# Altium schematic sheet JQ8400-FL语音模块原理图V1.1.SchDoc
size B; SheetNumber: 0; SheetTotal: 0
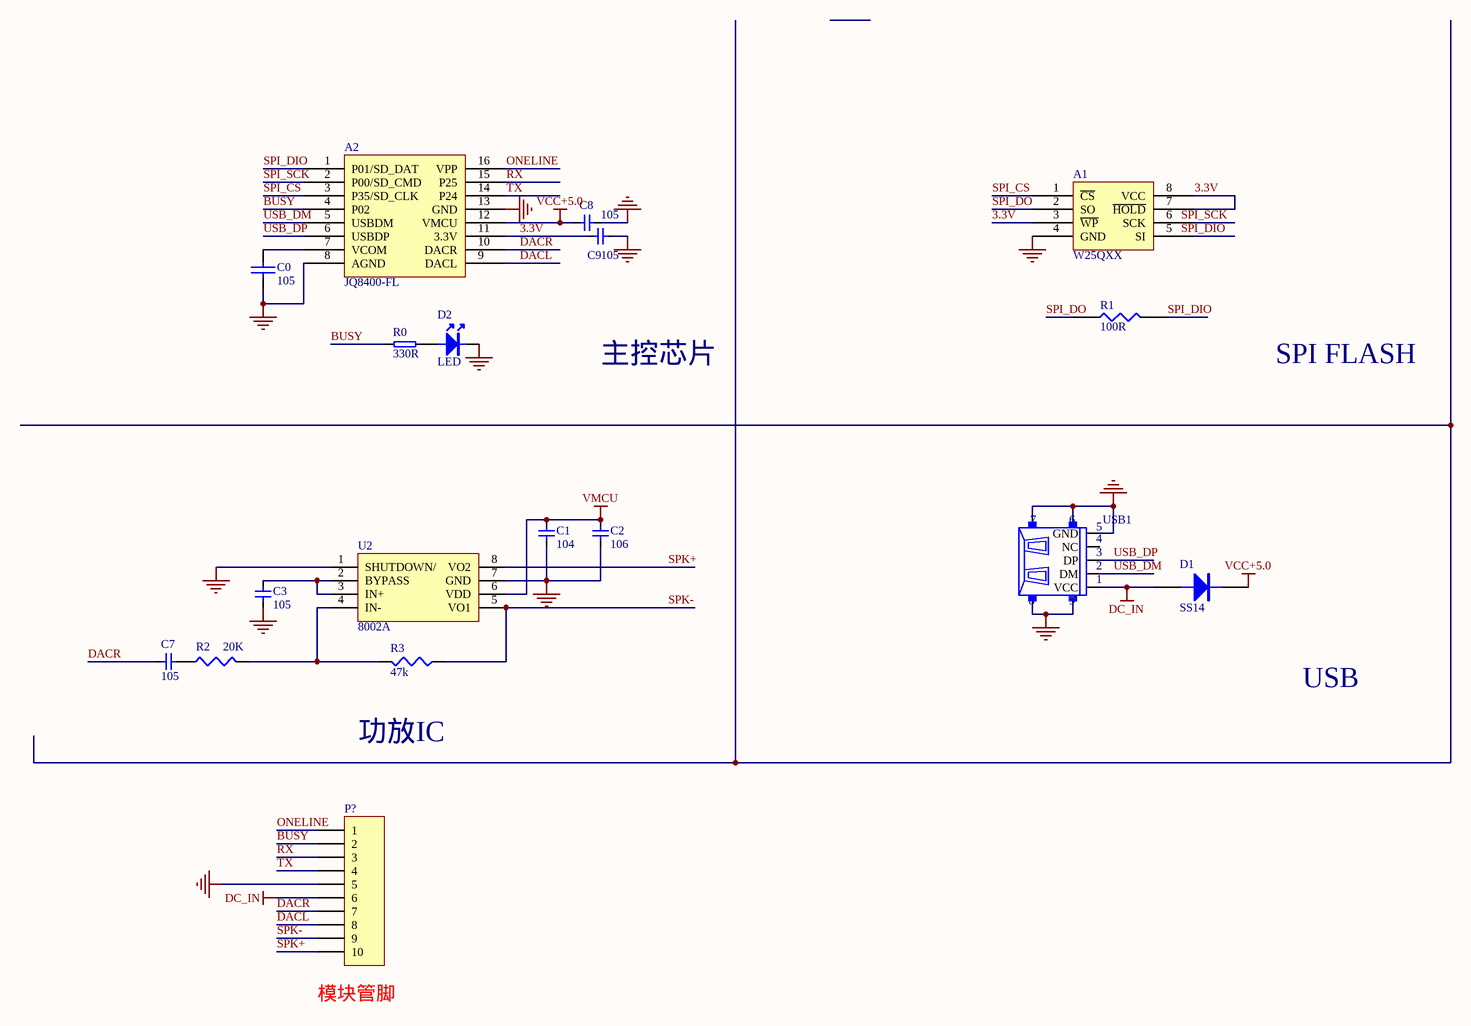
[diagram p0: JQ8400-FL语音模块原理图V1.1.SchDoc]

## Parts
A1  W25QXX  [LC-SOIC-8_208mil]
A2  JQ8400-FL  [LC-SOIC-16_150mil]
C0  105
C1  104  [LC-0603_C]
C2  106  [LC-0603_C]
C3  105  [LC-0603_C]
C7  105  [LC-0603_C]
C8  105  [LC-0603_C]
C9  105  [LC-0603_C]
D1  SS14  [LC-SOD-123]
D2  LED  [LC-0603_LED_S1]
P?  Header 10  [HDR1X10]  (value not drawn)
R0  330R  [LC-0603_R]
R1  100R
R2  20K  [LC-0603_R]
R3  47k  [LC-0603_R]
U2  8002A  [LC-SOIC-8_150mil]
USB1  USB-5PIN  [USB-miro]  (value not drawn)

## Nets
DC_IN: D1.1(A) P?.6 USB1.1(VCC)
GND: A1.4(GND) A2.8(AGND) A2.13(GND) C0.2 C1.1 C2.1 C3.1 C8.2 C9.2 D2.2 P?.5 U2.1(SHUTDOWN/) U2.7(GND) USB1.5(GND) USB1.6 USB1.7 USB1.8 USB1.9
VCC+5.0: A2.12(VMCU) C8.1 D1.2(K)
VMCU: C1.2 C2.2 U2.6(VDD)
3.3V: A1.3(~{WP}) A1.7(~{HOLD}) A1.8(VCC) A2.11(3.3V) C9.1
BUSY: A2.4(P02) P?.2 R0.2
DACL: A2.9(DACL) P?.8
DACR: A2.10(DACR) C7.1 P?.7
ONELINE: A2.16(VPP) P?.1
RX: A2.15(P25) P?.3
SPI_CS: A1.1(~{CS}) A2.3(P35/SD_CLK)
SPI_DIO: A2.1(P01/SD_DAT) R1.2
SPI_DO: A1.2(SO) R1.1
SPI_SCK: A2.2(P00/SD_CMD)
SPK+: P?.10 U2.8(VO2)
SPK-: P?.9 R3.1 U2.5(VO1)
TX: A2.14(P24) P?.4
USB_DM: A2.5(USBDM) USB1.2(DM)
USB_DP: A2.6(USBDP) USB1.3(DP)
NetA2_7: A2.7(VCOM) C0.1
NetC3_2: C3.2 U2.2(BYPASS) U2.3(IN+)
NetC7_2: C7.2 R2.1
NetD2_1: D2.1 R0.1
NetR2_2: R2.2 R3.2 U2.4(IN-)

Not connected (* = marked no-connect by the designer): A1 5(SI) 6(SCK); USB1 4(NC)

## Notes on the sheet
- 主控芯片
- SPI FLASH
- USB
- 功放IC
- (near P?) 模块管脚
- Labels drawn without touching a wire or pin: SPI_DIO, SPI_SCK

## Library data of the parts
A2 = W6082
C0-C3 C7-C9 = CAP: Capacitor
D1 = DIODE
P? = Header 10: Header, 10-Pin; LatestRevisionDate: 17-Jul-2002; LatestRevisionNote: Re-released for DXP Platform.; Publisher: Altium Limited
R0 = RES
R1 = RES1
R2 R3 = Res3: 0805.PcbLib; Published: 8-Jun-2000; LatestRevisionDate: 17-Jul-2002; LatestRevisionNote: Re-released for DXP Platform.; Publisher: Altium Limited
U2 = LM4890